# Altium schematic sheet source.SchDoc
size A4; SheetNumber: 1; SheetTotal: 3
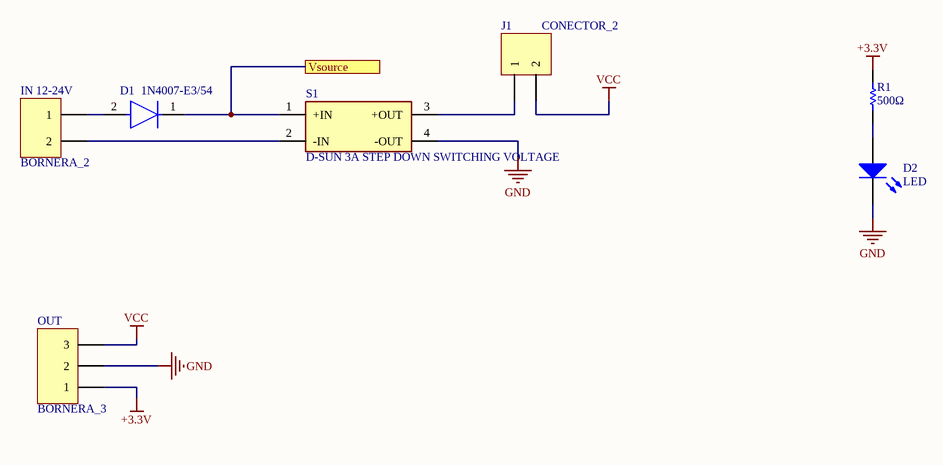
[diagram p0: source.SchDoc]

## Parts
D1  1N4007-E3/54  [FP-1N4007-MFG]
D2  LED  [FP-LED]
IN_12-24V  BORNERA_2  [BORNERA_2]
J1  CONECTOR_2  [PCBComponent_1]
OUT  BORNERA_3  [BORNERA_3]
R1  500Ω  [FP-RESISTENCIA]
S1  D-SUN 3A STEP DOWN SWITCHING VOLTAGE  [STEP_SOURCE]

## Ports
Vsource

## Nets
+3.3V: OUT.1 R1.1
GND: D2.2(K) OUT.2 S1.4(-OUT)
VCC: J1.2 OUT.3
Vsource: D1.1(C) S1.1(+IN) ; port Vsource
NetD1_2: D1.2(A) IN_12-24V.1
NetD2_1: D2.1(A) R1.2
NetIN_12-24V_2: IN_12-24V.2 S1.2(-IN)
NetJ1_1: J1.1 S1.3(+OUT)

## Library data of the parts
D1 = CMP-02540-000046-1: DIODE GEN PURP 1KV 1A DO204AL; Manufacturer: Vishay; Value: 15pF; Max Junction Temp: +150°C; Max Surge Forward Current: 30A; Max Repetitive Reverse Voltage: 1000V; Peak Reverse Current: 30uA; Octopart: https://octopart.com/1n4007-e3%2F54-vishay-39548207; Digikey Description: DIODE GEN PURP 1KV 1A DO204AL; Category: Diode; Mouser Description: Rectifiers Vr/1000V Io/1A; Automotive: No; Package: 1N4007; Device Class L3: Rectifier Diodes; Temperature Range High: +150°C; Capacitance: 15pF; Ipc Land Pattern Name: DIOPA1088W105L520D270; Lead Free: Yes; ComponentLink2Description: Datasheet; Forward Current: 1A; Device Class L1: Discrete Semiconductors; ComponentLink2URL: http://www.vishay.com/docs/88503/1n4001.pdf; Temperature Range Low: -50°C; Height: 2.7mm; RoHS: TRUE; Temperature: -50°C to +150°C; Device Class L2: Diodes; Manufacturer Part Number: 1N4007-E3/54
R1 = Resistencia